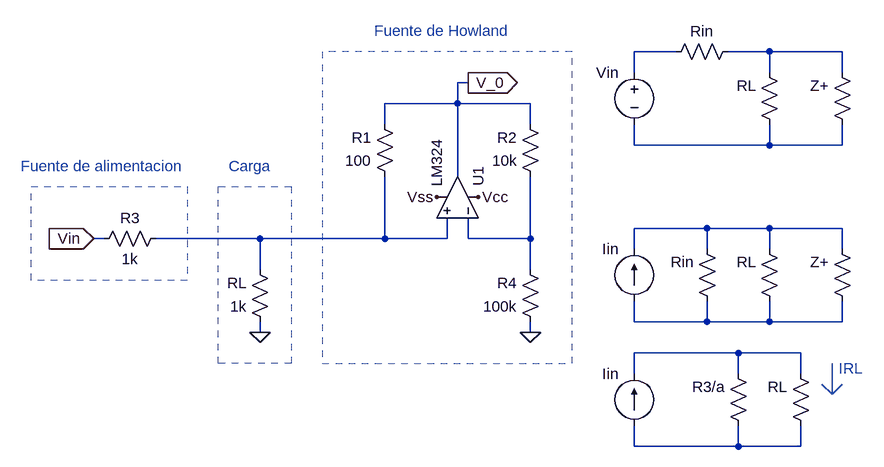
[diagram p0: schematic Lab_1_Circ_2_secciones.asc]
Lab_1_Circ_2_secciones.asc, the LTspice schematic file:
Version 4
SHEET 1 1560 868
WIRE 704 -304 640 -304
WIRE 848 -304 784 -304
WIRE 960 -304 848 -304
WIRE 640 -272 640 -304
WIRE 848 -272 848 -304
WIRE 960 -272 960 -304
WIRE 384 -256 368 -256
WIRE 368 -224 368 -256
WIRE 368 -224 256 -224
WIRE 480 -224 368 -224
WIRE 256 -192 256 -224
WIRE 480 -192 480 -224
WIRE 640 -160 640 -192
WIRE 848 -160 848 -192
WIRE 848 -160 640 -160
WIRE 960 -160 960 -192
WIRE 960 -160 848 -160
WIRE 368 -112 368 -224
WIRE 752 -32 640 -32
WIRE 848 -32 752 -32
WIRE 960 -32 848 -32
WIRE -176 -16 -192 -16
WIRE 64 -16 -96 -16
WIRE 256 -16 256 -112
WIRE 256 -16 64 -16
WIRE 352 -16 352 -48
WIRE 352 -16 256 -16
WIRE 384 -16 384 -48
WIRE 480 -16 480 -112
WIRE 480 -16 384 -16
WIRE 640 0 640 -32
WIRE 752 0 752 -32
WIRE 848 0 848 -32
WIRE 960 0 960 -32
WIRE 64 32 64 -16
WIRE 480 32 480 -16
WIRE 640 112 640 80
WIRE 752 112 752 80
WIRE 752 112 640 112
WIRE 848 112 848 80
WIRE 848 112 752 112
WIRE 960 112 960 80
WIRE 960 112 848 112
WIRE 64 128 64 112
WIRE 480 128 480 112
WIRE 800 160 640 160
WIRE 896 160 800 160
WIRE 640 192 640 160
WIRE 800 192 800 160
WIRE 896 192 896 160
WIRE 640 304 640 272
WIRE 800 304 800 272
WIRE 800 304 640 304
WIRE 896 304 896 272
WIRE 896 304 800 304
FLAG 64 128 0
FLAG 400 -80 Vcc
FLAG 336 -80 Vss
FLAG 384 -256 V_0
IOPIN 384 -256 Out
FLAG -192 -16 Vin
IOPIN -192 -16 In
FLAG 480 128 0
SYMBOL OpAmps\\opamp2 432 -80 M270
SYMATTR InstName U1
SYMATTR Value LM324
SYMBOL res 272 -96 R180
WINDOW 0 36 76 Left 2
WINDOW 3 36 40 Left 2
SYMATTR InstName R1
SYMATTR Value 100
SYMBOL res 496 -96 R180
WINDOW 0 36 76 Left 2
WINDOW 3 36 40 Left 2
SYMATTR InstName R2
SYMATTR Value 10k
SYMBOL res -80 -32 R90
WINDOW 0 0 56 VBottom 2
WINDOW 3 32 56 VTop 2
SYMATTR InstName R3
SYMATTR Value 1k
SYMBOL res 496 128 R180
WINDOW 0 36 76 Left 2
WINDOW 3 36 40 Left 2
SYMATTR InstName R4
SYMATTR Value 100k
SYMBOL res 80 128 R180
WINDOW 0 36 76 Left 2
WINDOW 3 36 40 Left 2
SYMATTR InstName RL
SYMATTR Value 1k
SYMBOL res 976 -176 R180
WINDOW 0 36 76 Left 2
WINDOW 3 36 40 Left 2
SYMATTR InstName Z+
SYMATTR Value ""
SYMBOL res 800 -320 R90
WINDOW 0 0 56 VBottom 2
WINDOW 3 32 56 VTop 2
SYMATTR InstName Rin
SYMATTR Value ""
SYMBOL res 864 -176 R180
WINDOW 0 36 76 Left 2
WINDOW 3 36 40 Left 2
SYMATTR InstName RL
SYMATTR Value ""
SYMBOL voltage 640 -288 M0
SYMATTR InstName Vin
SYMATTR Value ""
SYMBOL res 976 96 R180
WINDOW 0 36 76 Left 2
WINDOW 3 36 40 Left 2
SYMATTR InstName Z+
SYMATTR Value ""
SYMBOL res 864 96 R180
WINDOW 0 36 76 Left 2
WINDOW 3 36 40 Left 2
SYMATTR InstName RL
SYMATTR Value ""
SYMBOL current 640 80 R180
WINDOW 0 24 80 Left 2
WINDOW 3 24 0 Left 2
SYMATTR InstName Iin
SYMATTR Value ""
SYMBOL res 768 96 R180
WINDOW 0 36 76 Left 2
WINDOW 3 36 40 Left 2
SYMATTR InstName Rin
SYMATTR Value ""
SYMBOL res 912 288 R180
WINDOW 0 36 76 Left 2
WINDOW 3 36 40 Left 2
SYMATTR InstName RL
SYMATTR Value ""
SYMBOL current 640 272 R180
WINDOW 0 24 80 Left 2
WINDOW 3 24 0 Left 2
SYMATTR InstName Iin
SYMATTR Value ""
SYMBOL res 816 288 R180
WINDOW 0 36 76 Left 2
WINDOW 3 36 40 Left 2
SYMATTR InstName R3/a
SYMATTR Value ""
TEXT -304 -128 Left 2 ;Fuente de alimentacion
TEXT 240 -336 Left 2 ;Fuente de Howland
TEXT 16 -128 Left 2 ;Carga
TEXT 992 184 Right 2 ;IRL
LINE Normal 944 224 944 176
LINE Normal 944 224 960 208
LINE Normal 928 208 944 224
RECTANGLE Normal -48 48 -288 -96 1
RECTANGLE Normal 112 176 0 -96 1
RECTANGLE Normal 160 176 544 -304 1

The netlist it stands for:
* Lab_1_Circ_2_secciones.asc
XU1 N005 N006 Vcc Vss V_0 LM324  ; pins In+ In- V+ V- OUT
R1 N005 V_0 100
R2 N006 V_0 10k
R3 N005 Vin 1k
R4 0 N006 100k
RL 0 N005 1k
R§Z+ N003 N002
Rin N002 N001
RL N003 N002
Vin N001 N003
R§Z+ N007 N004
RL N007 N004
Iin N007 N004
Rin N007 N004
RL N009 N008
Iin N009 N008
R3/a N009 N008
* Fuente de alimentacion
* Fuente de Howland
* Carga
* IRL
.backanno
.end